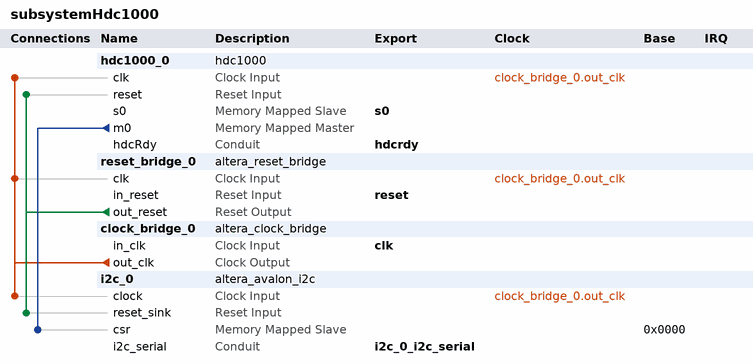
[diagram p0: system contents]
# Platform Designer (Qsys) system subsystemHdc1000, Cyclone V 5CSEMA5F31C6
# Parameters at their usual value, and those the tool derives, are not listed.
package require -exact qsys 18.1
create_system subsystemHdc1000
set_project_property DEVICE_FAMILY {Cyclone V}
set_project_property DEVICE 5CSEMA5F31C6

add_instance hdc1000_0 hdc1000 1.0
set_instance_parameter_value hdc1000_0 gClkFrequency 100000000

add_instance reset_bridge_0 altera_reset_bridge 18.1
set_instance_parameter_value reset_bridge_0 ACTIVE_LOW_RESET 1
set_instance_parameter_value reset_bridge_0 SYNCHRONOUS_EDGES deassert

add_instance clock_bridge_0 altera_clock_bridge 18.1
set_instance_parameter_value clock_bridge_0 DERIVED_CLOCK_RATE 0
set_instance_parameter_value clock_bridge_0 EXPLICIT_CLOCK_RATE 0

add_instance i2c_0 altera_avalon_i2c 18.1
set_instance_parameter_value i2c_0 FIFO_DEPTH 16

# connections
add_connection clock_bridge_0.out_clk hdc1000_0.clk clock
add_connection clock_bridge_0.out_clk i2c_0.clock clock
add_connection clock_bridge_0.out_clk reset_bridge_0.clk clock
add_connection reset_bridge_0.out_reset hdc1000_0.reset reset
add_connection reset_bridge_0.out_reset i2c_0.reset_sink reset
add_connection hdc1000_0.m0 i2c_0.csr avalon
set_connection_parameter_value hdc1000_0.m0/i2c_0.csr baseAddress 0x0000

# exported interfaces
add_interface clk clock sink
set_interface_property clk EXPORT_OF clock_bridge_0.in_clk
add_interface hdcrdy conduit end
set_interface_property hdcrdy EXPORT_OF hdc1000_0.hdcRdy
add_interface i2c_0_i2c_serial conduit end
set_interface_property i2c_0_i2c_serial EXPORT_OF i2c_0.i2c_serial
add_interface reset reset sink
set_interface_property reset EXPORT_OF reset_bridge_0.in_reset
add_interface s0 avalon slave
set_interface_property s0 EXPORT_OF hdc1000_0.s0

set_interconnect_requirement {$system} qsys_mm.clockCrossingAdapter HANDSHAKE
set_interconnect_requirement {$system} qsys_mm.enableEccProtection FALSE
set_interconnect_requirement {$system} qsys_mm.insertDefaultSlave FALSE
set_interconnect_requirement {$system} qsys_mm.maxAdditionalLatency 1

save_system subsystemHdc1000.qsys
